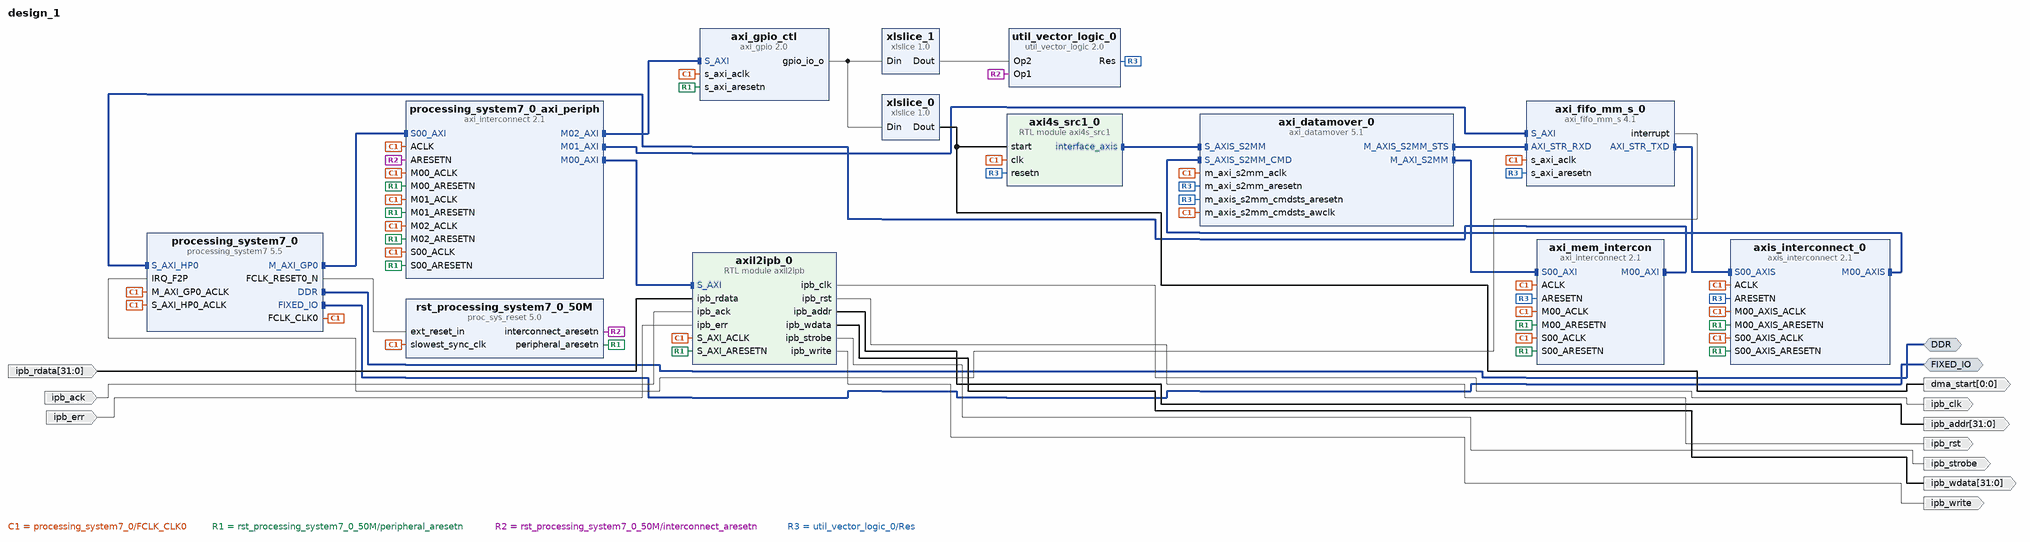
[diagram p0: block diagram of the top level]
# Vivado block design design_1, xc7z020clg400-1, Vivado 2017.4
create_bd_design design_1

create_bd_intf_port -mode Master -vlnv xilinx.com:interface:ddrx_rtl:1.0 DDR
create_bd_intf_port -mode Master -vlnv xilinx.com:display_processing_system7:fixedio_rtl:1.0 FIXED_IO
create_bd_port -dir O -type clk ipb_clk
create_bd_port -dir O -type rst ipb_rst
create_bd_port -dir O -from 31 -to 0 ipb_addr
create_bd_port -dir O -from 31 -to 0 ipb_wdata
create_bd_port -dir O ipb_strobe
create_bd_port -dir O ipb_write
create_bd_port -dir I -from 31 -to 0 ipb_rdata
create_bd_port -dir I ipb_ack
create_bd_port -dir I ipb_err
create_bd_port -dir O -from 0 -to 0 dma_start

create_bd_cell -type ip -vlnv xilinx.com:ip:processing_system7:5.5 processing_system7_0
set_property -dict [list \
  CONFIG.PCW_UIPARAM_DDR_FREQ_MHZ 533.333333 \
  CONFIG.PCW_APU_PERIPHERAL_FREQMHZ 666.666666 \
  CONFIG.PCW_SDIO_PERIPHERAL_FREQMHZ 50 \
  CONFIG.PCW_UART_PERIPHERAL_FREQMHZ 100 \
  CONFIG.PCW_FPGA0_PERIPHERAL_FREQMHZ 50 \
  CONFIG.PCW_FPGA1_PERIPHERAL_FREQMHZ 50 \
  CONFIG.PCW_USE_S_AXI_HP0 1 \
  CONFIG.PCW_M_AXI_GP0_FREQMHZ 10 \
  CONFIG.PCW_USE_FABRIC_INTERRUPT 1 \
  CONFIG.PCW_IRQ_F2P_INTR 1 \
  CONFIG.PCW_PERIPHERAL_BOARD_PRESET None \
  CONFIG.PCW_PRESET_BANK1_VOLTAGE {LVCMOS 1.8V} \
  CONFIG.PCW_UIPARAM_DDR_PARTNO {MT41J256M16 RE-125} \
  CONFIG.PCW_QSPI_PERIPHERAL_ENABLE 0 \
  CONFIG.PCW_ENET0_PERIPHERAL_ENABLE 1 \
  CONFIG.PCW_ENET0_ENET0_IO {MIO 16 .. 27} \
  CONFIG.PCW_ENET0_GRP_MDIO_ENABLE 1 \
  CONFIG.PCW_ENET0_GRP_MDIO_IO EMIO \
  CONFIG.PCW_ENET_RESET_ENABLE 1 \
  CONFIG.PCW_ENET_RESET_SELECT {Share reset pin} \
  CONFIG.PCW_ENET0_RESET_ENABLE 0 \
  CONFIG.PCW_SD0_PERIPHERAL_ENABLE 1 \
  CONFIG.PCW_SD0_SD0_IO {MIO 40 .. 45} \
  CONFIG.PCW_SD0_GRP_CD_ENABLE 1 \
  CONFIG.PCW_SD0_GRP_CD_IO {MIO 46} \
  CONFIG.PCW_SD0_GRP_WP_ENABLE 1 \
  CONFIG.PCW_SD0_GRP_WP_IO {MIO 47} \
  CONFIG.PCW_UART1_PERIPHERAL_ENABLE 1 \
  CONFIG.PCW_UART1_UART1_IO {MIO 48 .. 49} \
  CONFIG.PCW_USB0_PERIPHERAL_ENABLE 0 \
  CONFIG.PCW_USB_RESET_ENABLE 0 \
  CONFIG.PCW_I2C_RESET_ENABLE 0 \
  CONFIG.PCW_GPIO_MIO_GPIO_ENABLE 1 \
  CONFIG.PCW_GPIO_MIO_GPIO_IO MIO \
  CONFIG.PCW_UIPARAM_GENERATE_SUMMARY NONE \
] [get_bd_cells processing_system7_0]
# 480 more settings of processing_system7_0 are not shown: defaults, MIO pin electricals, DDR timing, and values the tool derives
create_bd_cell -type ip -vlnv xilinx.com:ip:axi_interconnect:2.1 processing_system7_0_axi_periph
set_property -dict {CONFIG.NUM_SI 1 CONFIG.NUM_MI 3} [get_bd_cells processing_system7_0_axi_periph]
create_bd_cell -type ip -vlnv xilinx.com:ip:proc_sys_reset:5.0 rst_processing_system7_0_50M
create_bd_cell -type module -reference axil2ipb axil2ipb_0
create_bd_cell -type ip -vlnv xilinx.com:ip:axi_interconnect:2.1 axi_mem_intercon
set_property -dict {CONFIG.NUM_SI 1 CONFIG.NUM_MI 1} [get_bd_cells axi_mem_intercon]
create_bd_cell -type ip -vlnv xilinx.com:ip:axi_gpio:2.0 axi_gpio_ctl
set_property -dict {CONFIG.C_GPIO_WIDTH 2 CONFIG.C_ALL_OUTPUTS 1} [get_bd_cells axi_gpio_ctl]
create_bd_cell -type module -reference axi4s_src1 axi4s_src1_0
create_bd_cell -type ip -vlnv xilinx.com:ip:axi_fifo_mm_s:4.1 axi_fifo_mm_s_0
set_property -dict [list \
  CONFIG.C_HAS_AXIS_TSTRB true \
  CONFIG.C_HAS_AXIS_TKEEP true \
  CONFIG.C_USE_TX_CTRL 0 \
] [get_bd_cells axi_fifo_mm_s_0]
create_bd_cell -type ip -vlnv xilinx.com:ip:axi_datamover:5.1 axi_datamover_0
set_property -dict [list \
  CONFIG.c_s2mm_support_indet_btt true \
  CONFIG.c_enable_cache_user false \
  CONFIG.c_enable_mm2s 0 \
  CONFIG.c_addr_width 32 \
] [get_bd_cells axi_datamover_0]
create_bd_cell -type ip -vlnv xilinx.com:ip:axis_interconnect:2.1 axis_interconnect_0
set_property -dict {CONFIG.NUM_MI 1 CONFIG.ARB_ON_TLAST 0} [get_bd_cells axis_interconnect_0]
create_bd_cell -type ip -vlnv xilinx.com:ip:xlslice:1.0 xlslice_0
set_property -dict {CONFIG.DIN_TO 1 CONFIG.DIN_FROM 1 CONFIG.DIN_WIDTH 2 CONFIG.DOUT_WIDTH 1} [get_bd_cells xlslice_0]
create_bd_cell -type ip -vlnv xilinx.com:ip:xlslice:1.0 xlslice_1
set_property -dict {CONFIG.DIN_TO 0 CONFIG.DIN_FROM 0 CONFIG.DIN_WIDTH 2} [get_bd_cells xlslice_1]
create_bd_cell -type ip -vlnv xilinx.com:ip:util_vector_logic:2.0 util_vector_logic_0
set_property -dict {CONFIG.C_SIZE 1} [get_bd_cells util_vector_logic_0]

# ---- connections ----

connect_bd_intf_net [get_bd_intf_pins processing_system7_0/M_AXI_GP0] [get_bd_intf_pins processing_system7_0_axi_periph/S00_AXI]
connect_bd_intf_net [get_bd_intf_pins processing_system7_0_axi_periph/M00_AXI] [get_bd_intf_pins axil2ipb_0/S_AXI]
connect_bd_intf_net [get_bd_intf_pins axi_mem_intercon/M00_AXI] [get_bd_intf_pins processing_system7_0/S_AXI_HP0]
connect_bd_intf_net [get_bd_intf_pins processing_system7_0_axi_periph/M02_AXI] [get_bd_intf_pins axi_gpio_ctl/S_AXI]
connect_bd_intf_net [get_bd_intf_pins axi_fifo_mm_s_0/AXI_STR_RXD] [get_bd_intf_pins axi_datamover_0/M_AXIS_S2MM_STS]
connect_bd_intf_net [get_bd_intf_pins processing_system7_0_axi_periph/M01_AXI] [get_bd_intf_pins axi_fifo_mm_s_0/S_AXI]
connect_bd_intf_net [get_bd_intf_pins axi_datamover_0/M_AXI_S2MM] [get_bd_intf_pins axi_mem_intercon/S00_AXI]
connect_bd_intf_net [get_bd_intf_pins axi4s_src1_0/interface_axis] [get_bd_intf_pins axi_datamover_0/S_AXIS_S2MM]
connect_bd_intf_net [get_bd_intf_pins axis_interconnect_0/M00_AXIS] [get_bd_intf_pins axi_datamover_0/S_AXIS_S2MM_CMD]
connect_bd_intf_net [get_bd_intf_pins axi_fifo_mm_s_0/AXI_STR_TXD] [get_bd_intf_pins axis_interconnect_0/S00_AXIS]
connect_bd_intf_net [get_bd_intf_ports DDR] [get_bd_intf_pins processing_system7_0/DDR]
connect_bd_intf_net [get_bd_intf_ports FIXED_IO] [get_bd_intf_pins processing_system7_0/FIXED_IO]
connect_bd_net [get_bd_pins processing_system7_0/FCLK_CLK0] \
  [get_bd_pins processing_system7_0/M_AXI_GP0_ACLK] [get_bd_pins rst_processing_system7_0_50M/slowest_sync_clk] \
  [get_bd_pins axil2ipb_0/S_AXI_ACLK] [get_bd_pins processing_system7_0/S_AXI_HP0_ACLK] [get_bd_pins axi_gpio_ctl/s_axi_aclk] \
  [get_bd_pins axi4s_src1_0/clk] [get_bd_pins axi_fifo_mm_s_0/s_axi_aclk] [get_bd_pins axi_datamover_0/m_axi_s2mm_aclk] \
  [get_bd_pins axi_datamover_0/m_axis_s2mm_cmdsts_awclk] [get_bd_pins processing_system7_0_axi_periph/ACLK] \
  [get_bd_pins processing_system7_0_axi_periph/S00_ACLK] [get_bd_pins processing_system7_0_axi_periph/M00_ACLK] \
  [get_bd_pins axi_mem_intercon/S00_ACLK] [get_bd_pins axi_mem_intercon/ACLK] [get_bd_pins axi_mem_intercon/M00_ACLK] \
  [get_bd_pins processing_system7_0_axi_periph/M01_ACLK] [get_bd_pins processing_system7_0_axi_periph/M02_ACLK] \
  [get_bd_pins axis_interconnect_0/ACLK] [get_bd_pins axis_interconnect_0/S00_AXIS_ACLK] \
  [get_bd_pins axis_interconnect_0/M00_AXIS_ACLK]
connect_bd_net [get_bd_pins processing_system7_0/FCLK_RESET0_N] [get_bd_pins rst_processing_system7_0_50M/ext_reset_in]
connect_bd_net [get_bd_pins rst_processing_system7_0_50M/peripheral_aresetn] \
  [get_bd_pins axil2ipb_0/S_AXI_ARESETN] [get_bd_pins axi_gpio_ctl/s_axi_aresetn] \
  [get_bd_pins processing_system7_0_axi_periph/S00_ARESETN] [get_bd_pins processing_system7_0_axi_periph/M00_ARESETN] \
  [get_bd_pins axi_mem_intercon/S00_ARESETN] [get_bd_pins axi_mem_intercon/M00_ARESETN] \
  [get_bd_pins processing_system7_0_axi_periph/M01_ARESETN] [get_bd_pins processing_system7_0_axi_periph/M02_ARESETN] \
  [get_bd_pins axis_interconnect_0/S00_AXIS_ARESETN] [get_bd_pins axis_interconnect_0/M00_AXIS_ARESETN]
connect_bd_net [get_bd_pins rst_processing_system7_0_50M/interconnect_aresetn] \
  [get_bd_pins util_vector_logic_0/Op1] [get_bd_pins processing_system7_0_axi_periph/ARESETN]
connect_bd_net [get_bd_pins axil2ipb_0/ipb_clk] [get_bd_ports ipb_clk]
connect_bd_net [get_bd_pins axil2ipb_0/ipb_rst] [get_bd_ports ipb_rst]
connect_bd_net [get_bd_pins axil2ipb_0/ipb_addr] [get_bd_ports ipb_addr]
connect_bd_net [get_bd_pins axil2ipb_0/ipb_wdata] [get_bd_ports ipb_wdata]
connect_bd_net [get_bd_pins axil2ipb_0/ipb_strobe] [get_bd_ports ipb_strobe]
connect_bd_net [get_bd_pins axil2ipb_0/ipb_write] [get_bd_ports ipb_write]
connect_bd_net [get_bd_ports ipb_rdata] [get_bd_pins axil2ipb_0/ipb_rdata]
connect_bd_net [get_bd_ports ipb_ack] [get_bd_pins axil2ipb_0/ipb_ack]
connect_bd_net [get_bd_ports ipb_err] [get_bd_pins axil2ipb_0/ipb_err]
connect_bd_net -net axi_gpio_0_gpio_io_o [get_bd_pins xlslice_0/Dout] [get_bd_ports dma_start] [get_bd_pins axi4s_src1_0/start]
connect_bd_net [get_bd_pins axi_fifo_mm_s_0/interrupt] [get_bd_pins processing_system7_0/IRQ_F2P]
connect_bd_net -net axi_gpio_0_gpio_io_o1 [get_bd_pins axi_gpio_ctl/gpio_io_o] [get_bd_pins xlslice_0/Din] [get_bd_pins xlslice_1/Din]
connect_bd_net [get_bd_pins xlslice_1/Dout] [get_bd_pins util_vector_logic_0/Op2]
connect_bd_net [get_bd_pins util_vector_logic_0/Res] \
  [get_bd_pins axi_datamover_0/m_axi_s2mm_aresetn] [get_bd_pins axis_interconnect_0/ARESETN] \
  [get_bd_pins axi_mem_intercon/ARESETN] [get_bd_pins axi_fifo_mm_s_0/s_axi_aresetn] \
  [get_bd_pins axi_datamover_0/m_axis_s2mm_cmdsts_aresetn] [get_bd_pins axi4s_src1_0/resetn]

# ---- address map ----
assign_bd_address -offset 0x00000000 -range 1G -target_address_space [get_bd_addr_spaces axi_datamover_0/Data_S2MM] [get_bd_addr_segs processing_system7_0/S_AXI_HP0/HP0_DDR_LOWOCM]
assign_bd_address -offset 0x41200000 -range 64K -target_address_space [get_bd_addr_spaces processing_system7_0/Data] [get_bd_addr_segs axi_gpio_ctl/S_AXI/Reg]
assign_bd_address -offset 0x43C00000 -range 64K -target_address_space [get_bd_addr_spaces processing_system7_0/Data] [get_bd_addr_segs axil2ipb_0/S_AXI/reg0]
assign_bd_address -offset 0x43C10000 -range 64K -target_address_space [get_bd_addr_spaces processing_system7_0/Data] [get_bd_addr_segs axi_fifo_mm_s_0/S_AXI/Mem0]

validate_bd_design
save_bd_design
